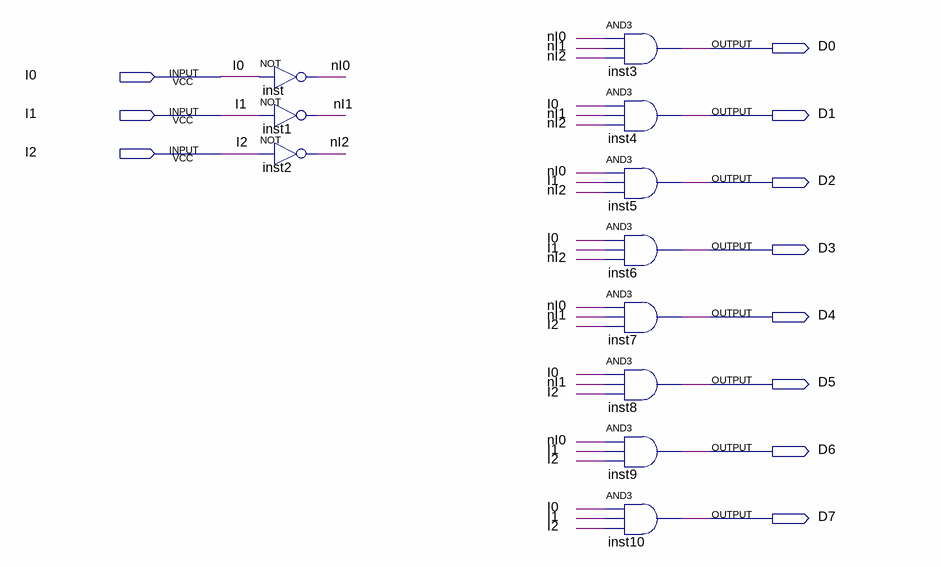
[diagram p0: schematic sheet]
// Quartus schematic DC8.bdf as structural Verilog: 11 symbols, 11 pins
module DC8 (
  input  I0,
  input  I1,
  input  I2,
  output D0,
  output D1,
  output D2,
  output D3,
  output D4,
  output D5,
  output D6,
  output D7
);

  wire nI0, nI1, nI2;

  not inst (nI0, I0);
  not inst1 (nI1, I1);
  not inst2 (nI2, I2);
  and inst3 (D0, nI0, nI1, nI2);
  and inst4 (D1, I0, nI1, nI2);
  and inst5 (D2, nI0, I1, nI2);
  and inst6 (D3, I0, I1, nI2);
  and inst7 (D4, nI0, nI1, I2);
  and inst8 (D5, I0, nI1, I2);
  and inst9 (D6, nI0, I1, I2);
  and inst10 (D7, I0, I1, I2);
endmodule
